# EAGLE design SC_1 (EAGLE 6.3)
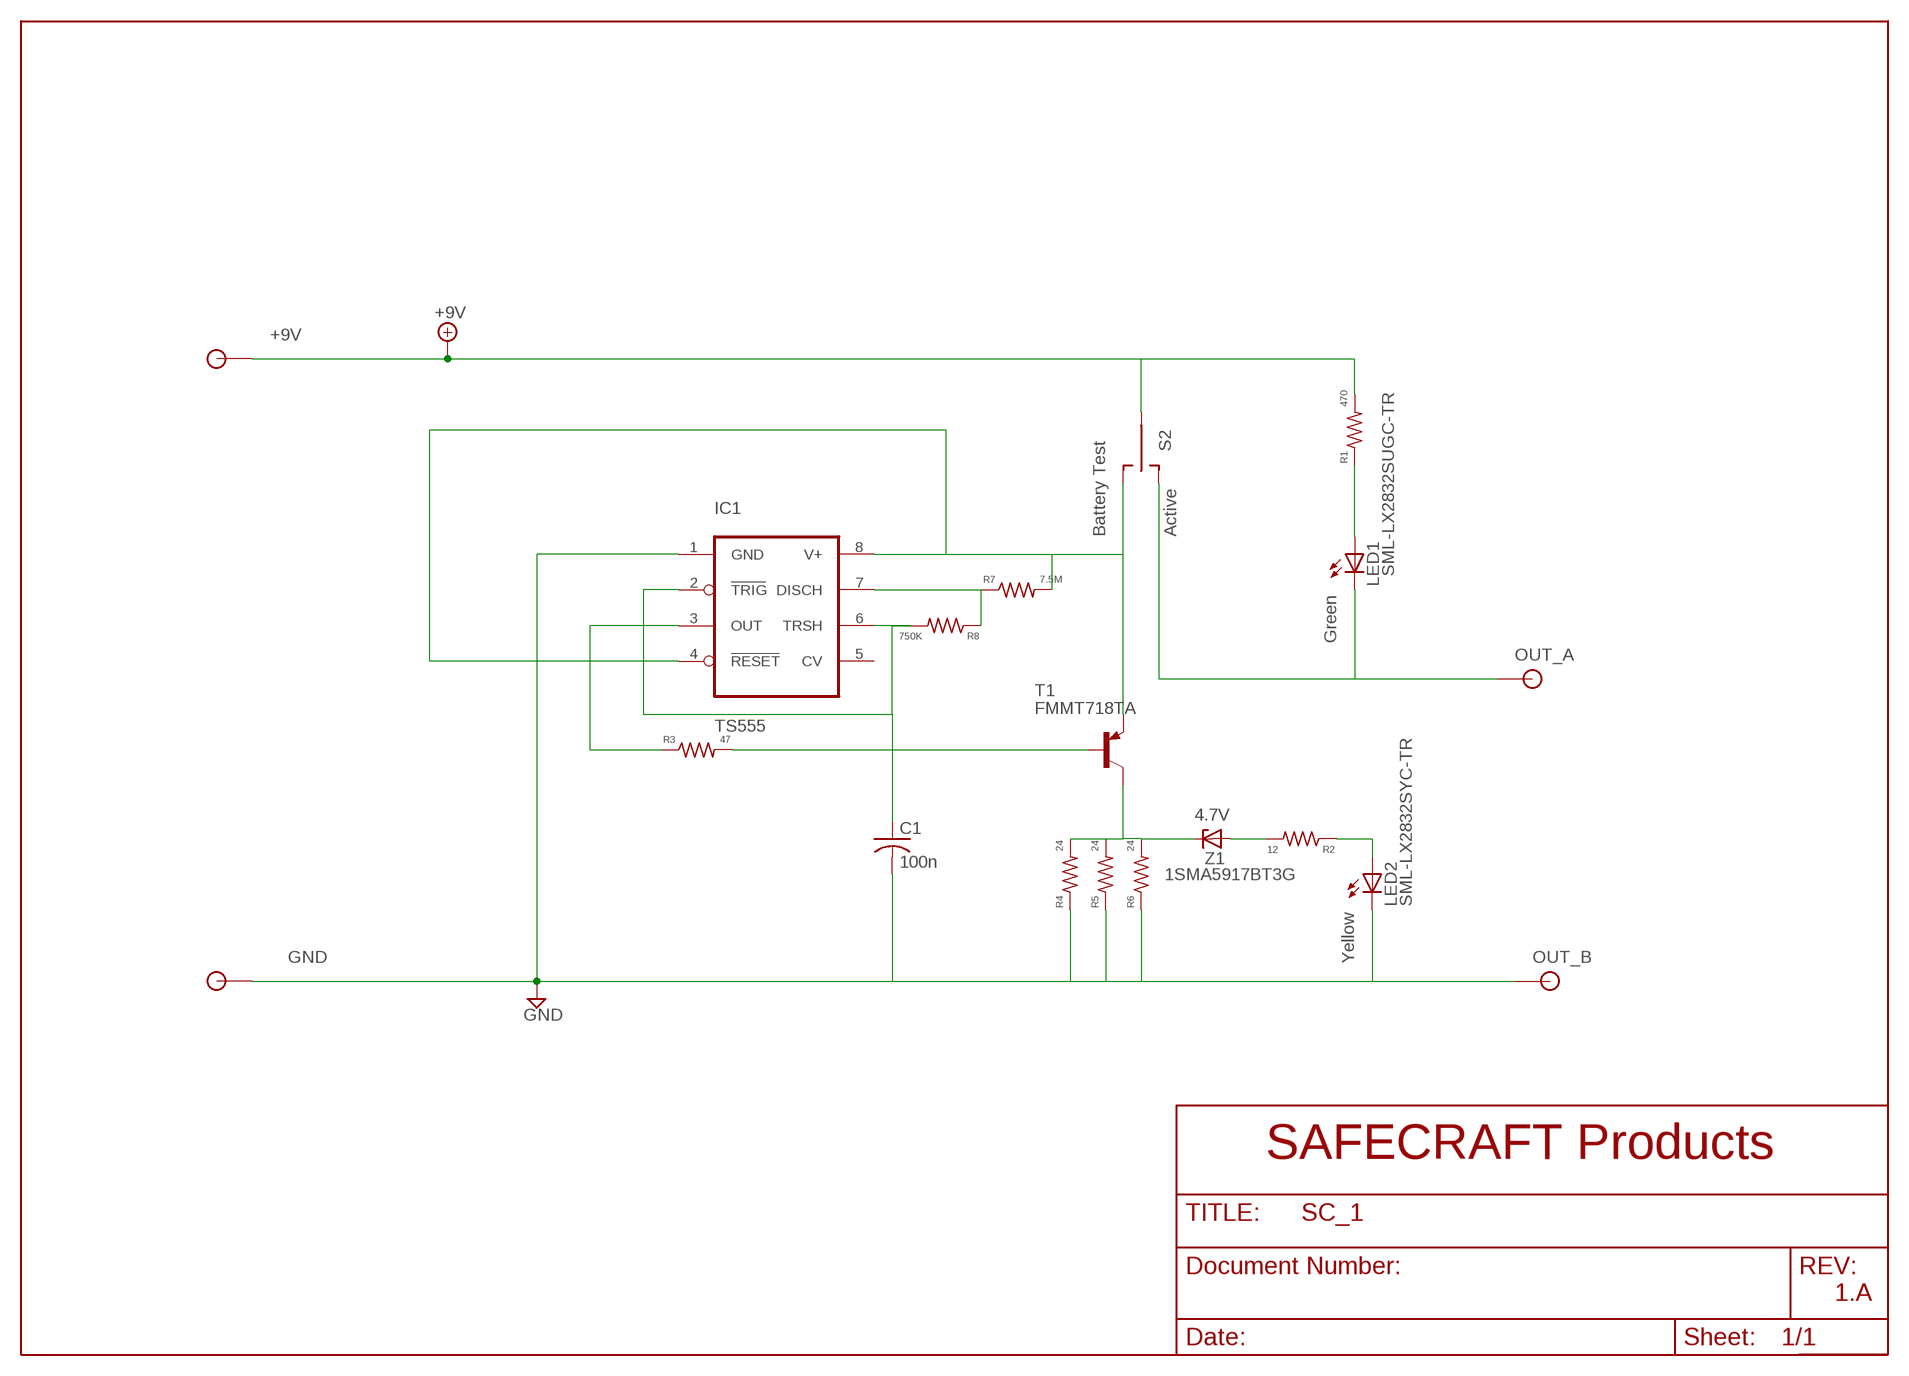
[diagram p0: schematic, sheet 1]

## Parts
C1  100n  C-USC0805  [C0805]
IC1  TS555  ICM7555SO08  [SO08]
LED1  SML-LX2832SUGC-TR  LEDP-LCC-2  [P-LCC-2]
LED2  SML-LX2832SYC-TR  LEDP-LCC-2  [P-LCC-2]
R1  470  R-US_R0805  [R0805]
R2  12  R-US_R0805  [R0805]
R3  47  R-US_R0805  [R0805]
R4  24  R-US_R1206  [R1206]
R5  24  R-US_R1206  [R1206]
R6  24  R-US_R1206  [R1206]
R7  7.5M  R-US_R0805  [R0805]
R8  750K  R-US_R0805  [R0805]
S2  TL39POB  [TL3XPO_NOHOLES]
T1  FMMT718TA  BC807-16-PNP-SOT23-BEC  [SOT23-BEC]
U$1  SOLDERPAD_NOHOLE  [SOLDERPAD_NOHOLES]
U$2  SOLDERPAD_NOHOLE  [SOLDERPAD_NOHOLES]
U$3  SOLDERPAD_NOHOLE  [SOLDERPAD_NOHOLES]
U$4  SOLDERPAD_NOHOLE  [SOLDERPAD_NOHOLES]
Z1  1SMA5917BT3G  ZENER-DIODESMB  [SMB]

## Nets
+9V: R1.2 S2.P$2(P) U$3.P$1
GND: C1.2 IC1.1(GND) LED2.C R4.1 R5.1 R6.1 U$2.P$1 U$4.P$1
N$1: IC1.4(RESET) IC1.8(V+) R7.2 S2.P$3(S) T1.E
N$5: R2.2 Z1.A
N$6: LED1.A R1.1
N$7: C1.1 IC1.2(TRIG) IC1.6(TRSH) R8.2
N$8: LED2.A R2.1
N$9: R3.2 T1.B
N$10: IC1.3(OUT) R3.1
N$12: IC1.7(DISCH) R7.1 R8.1
N$13: R4.2 R5.2 R6.2 T1.C Z1.C
OUT_A: LED1.C S2.P$1(O) U$1.P$1
Unconnected: IC1.5(CV)

## Notes on the sheet
- Battery Test | Active
- Green
- 4.7V
- Yellow | OUT_B
- SAFECRAFT Products
- 1.A

## Library data of the parts
C1 = rcl:C-US: CAPACITOR, American symbol
IC1 = Stofer:ICM7555: TIMER
LED1 LED2 = led:LED: LED OSRAM: - CHIPLED LG R971, LG N971, LY N971, LG Q971, LY Q971, LO R971, LY R971 LH N974, LH R974 LS Q976, LO Q976, LY Q976 LO Q996 - Hyper CHIPLED LW Q18S LB Q993, LB Q99A, LB R99A - SideLED LS A670, LO A670, LY A670, LG A670, LP A670 LB A673, LV A673, LT A673, LW A673 LH A674 LY A675 LS A676, LA A676, LO A676, LY A676, LW A676 LS A679, LY A679, LG A679 - Hyper Micro SIDELED® LS Y876, LA Y876, LO Y876, LY Y876 LT Y87S - SmartLED LW L88C, LW L88S LB L89C, LB L89S, LG L890 LS L89K, LO L89K, LY L89K LS L896, LA L896, LO L896, LY L896 - TOPLED LS T670, LO T670, LY T670, LG T670, LP T670 LSG T670, LSP T670, LSY T670, LOP T670, LYG T670 LG T671, LOG T671, LSG T671 LB T673, LV T673, LT T673, LW T673 LH T674 LS T676, LA T676, LO T676, LY T676, LB T676, LH T676, LSB T676, LW T676 LB T67C, LV T67C, LT T67C, LS T67K, LO T67K, LY T67K, LW E67C LS E67B, LA E67B, LO E67B, LY E67B, LB E67C, LV E67C, LT E67C LW T67C LS T679, LY T679, LG T679 LS T770, LO T770, LY T770, LG T770, LP T770 LB T773, LV T773, LT T773, LW T773 LH T774 LS E675, LA E675, LY E675, LS T675 LS T776, LA T776, LO T776, LY T776, LB T776 LHGB T686 LT T68C, LB T68C - Hyper Mini TOPLED® LB M676 - Mini TOPLED Santana® LG M470 LS M47K, LO M47K, LY M47K Source: http://www.osram.convergy.de LUXEON: - LUMILED® LXK2-PW12-R00, LXK2-PW12-S00, LXK2-PW14-U00, LXK2-PW14-V00 LXK2-PM12-R00, LXK2-PM12-S00, LXK2-PM14-U00 LXK2-PE12-Q00, LXK2-PE12-R00, LXK2-PE12-S00, LXK2-PE14-T00, LXK2-PE14-U00 LXK2-PB12-K00, LXK2-PB12-L00, LXK2-PB12-M00, LXK2-PB14-N00, LXK2-PB14-P00, LXK2-PB14-Q00 LXK2-PR12-L00, LXK2-PR12-M00, LXK2-PR14-Q00, LXK2-PR14-R00 LXK2-PD12-Q00, LXK2-PD12-R00, LXK2-PD12-S00 LXK2-PH12-R00, LXK2-PH12-S00 LXK2-PL12-P00, LXK2-PL12-Q00, LXK2-PL12-R00 Source: www.luxeon.com KINGBRIGHT: KA-3528ASYC Source: www.kingbright.com
R1-R8 = rcl:R-US_: RESISTOR, American symbol
S2 = switch:TL39PO: TINY SWITCH ON OFF ON Source: http://www2.produktinfo.conrad.com/datenblaetter/700000-724999/705152-da-01-de-Subminiaturschalter_TL_36YO.pdf
T1 = transistor:*-PNP-: PNP Transistror
U$1-U$4 = 1AA_Stofer:SOLDERPAD_NOHOLE
Z1 = diode:ZENER-DIODE: Z-Diode

## Board
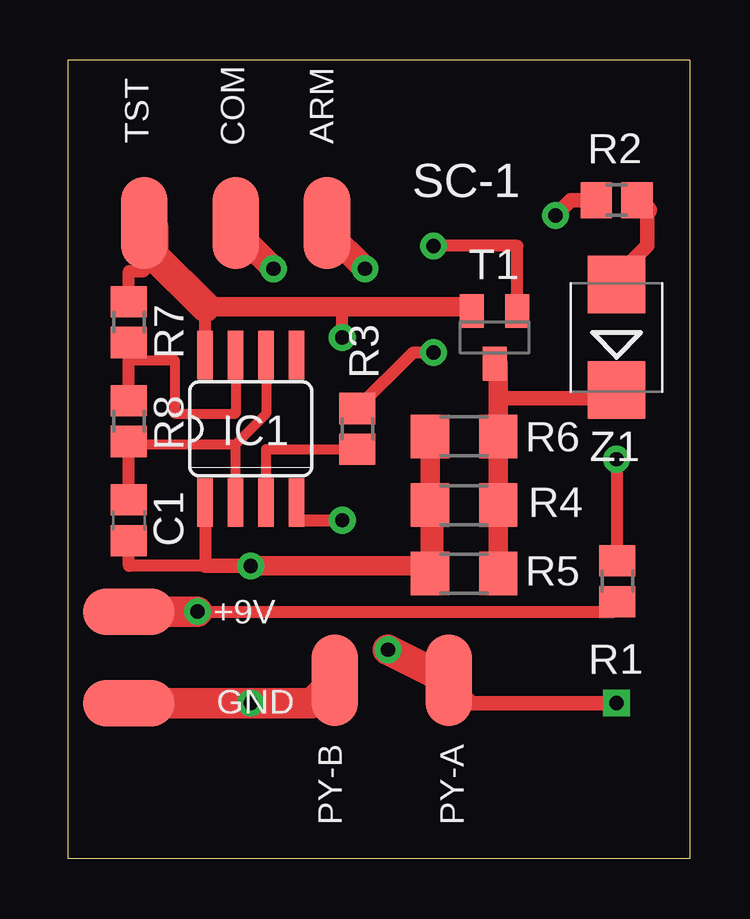
[diagram p1: board, top side]
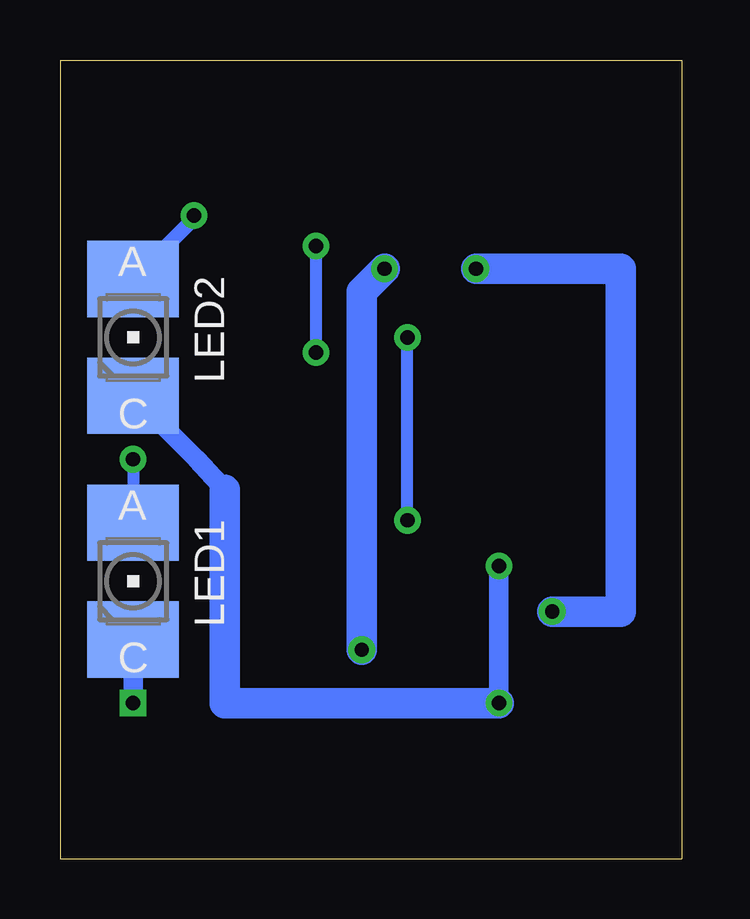
[diagram p2: board, bottom side, seen from below]

Size 25.91 x 33.27 mm. Coordinates in mm from the lower left corner, seen from the top.
Outline: 25.91,0 0,0 0,33.27 25.91,33.27 25.91,0
Copper layers (1*16): Top 0.035mm / dielectric 1.5mm / Bottom 0.035mm
Design rules "sparkfun": minimum track width 8mil, minimum drill 20mil, track to track 8mil, track to pad 8mil, pad to pad 8mil, via to via 8mil, smd to smd 8mil, copper to edge 10mil, drill to drill 8mil, minimum pad ring 12mil, minimum via ring 10mil, stop-mask expansion 4mil, vias tented up to drill 25mil, thermal gap 10mil

### Footprints (pad centres in the part's own frame; a part is rotated, then mirrored left to right if it is on the bottom)
C0805 = smd 1.3 x 1.5: 1 -0.85,0; 2 0.85,0
SO08 = smd 0.66 x 2.032: 1 -1.905,-3.073; 2 -0.635,-3.073; 3 0.635,-3.073; 4 1.905,-3.073; 5 1.905,3.073; 6 0.635,3.073; 7 -0.635,3.073; 8 -1.905,3.073
P-LCC-2 = smd 3.81 x 3.175: A 0,2.433; C 0,-2.433
R0805 = smd 1.3 x 1.5: 1 -0.85,0; 2 0.85,0
R1206 = smd 1.6 x 1.803: 1 -1.422,0; 2 1.422,0
TL3XPO_NOHOLES = smd 1.93 x 3.81: P$1 -3.81,0; P$2 0,0; P$3 3.81,0
SOT23-BEC = smd 1 x 1.4: B -0.95,-1.1; C 0,1.1; E 0.95,-1.1
SOLDERPAD_NOHOLES = smd 3.81 x 1.93: P$1 0,0
SMB = smd 2.4 x 2.4: A 2.2,0; C -2.2,0

### Placement (x,y rotation side)
C1  2.54,14.1 270 top
IC1  7.62,17.91 0 top
LED1  22.86,11.56 0 bottom
LED2  22.86,21.72 0 bottom
R1  22.89,11.56 270 top
R2  22.86,27.43 0 top
R3  12.06,17.91 90 top
R4  16.51,14.73 0 top
R5  16.51,11.87 0 top
R6  16.51,17.59 0 top
R7  2.54,22.35 90 top
R8  2.54,18.22 270 top
S2  6.98,26.48 180 top
T1  17.78,21.72 180 top
U$1  15.87,7.43 90 top
U$2  11.11,7.43 90 top
U$3  2.54,10.29 0 top
U$4  2.54,6.48 0 top
Z1  22.86,21.72 90 top

### Tracks (layer width: path | path; a pad name or v marks a point on that pad's centre or on a via)
+9V  (via drill 0.6)
  Top 0.406: 22.76,10.29 arc90 R1.2
  Top 0.508: v5.4,10.29 22.76,10.29
  Top 1.016: S2.P$2 6.98,26.16 v8.57,24.57
  Top 1.27: U$3.P$1 v5.4,10.29
  Bottom 1.27: v5.4,10.29 U$3.P$1 2.54,24.57 v8.57,24.57
GND  (via drill 0.6)
  Top 0.406: R5.1 15.09,12.19
  Top 0.508: IC1.1 5.71,12.19 2.54,12.19 C1.2
  Top 0.61: v7.62,12.19 5.71,12.19
  Top 0.813: R6.1 R4.1 | R4.1 R5.1 14.77,12.19 | R4.1 15.24,14.58 15.24,12.19 | 15.24,12.19 15.24,11.56 | 15.24,12.19 v7.62,12.19
  Top 1.27: U$4.P$1 v7.62,6.48 10.16,6.48 U$2.P$1
  Bottom 0.813: 19.05,15.37 20.21,16.64 LED2.C | v7.62,6.48 v7.62,12.19
  Bottom 1.27: 19.05,15.37 19.05,6.48 v7.62,6.48
N$1  (via drill 0.6)
  Top 0.406: IC1.4 9.53,14.1
  Top 0.508: IC1.8 5.71,22.99 | 3.56,26.29 S2.P$3 3.18,24.47 2.54,24.47 R7.2 | 9.53,14.1 v11.43,14.1 | v11.43,21.72 11.43,22.99
  Top 0.813: 5.71,22.99 11.43,22.99 16.66,22.99 T1.E
  Top 1.27: 5.71,22.99 3.56,25.15 3.56,26.29
  Bottom 0.508: v11.43,14.1 v11.43,21.72
N$5
  Top 0.61: 22.86,24.26 24.13,25.53 24.13,27.01
  Top 0.813: Z1.A 22.86,24.26 | 24.13,27.01 R2.2
N$6  (via drill 0.6)
  Top 0.508: v22.86,16.64 22.86,12.41 R1.1
  Bottom 0.508: v22.86,16.64 LED1.A
N$7
  Top 0.406: 2.54,17.27 6.98,17.27 | IC1.2 6.98,17.27 | IC1.6 8.26,18.54 6.98,17.27
  Top 0.508: R8.2 2.54,17.27 C1.1
N$8  (via drill 0.6)
  Top 0.61: R2.1 20.95,27.43 v20.32,26.8
  Bottom 0.61: v20.32,26.8 20.32,26.69 LED2.A
N$9  (via drill 0.6)
  Top 0.508: T1.B 18.73,25.53 v15.24,25.53 | v15.24,21.08 14.39,21.08 R3.2
  Bottom 0.508: v15.24,21.08 v15.24,25.53
N$10
  Top 0.406: IC1.3 8.26,17.06 R3.1
N$12
  Top 0.406: 2.54,20.76 4.45,20.76 4.45,18.54 6.98,18.54 IC1.7
  Top 0.508: R8.1 2.54,20.76 R7.1
N$13
  Top 0.406: 17.93,20.62 T1.C | Z1.C 22.86,19.18
  Top 0.61: 22.86,19.18 17.93,19.18
  Top 0.813: R5.2 R4.2 R6.2 17.93,19.18 17.93,20.62
OUT_A  (via drill 0.6)
  Top 0.61: v22.86,6.48 16.83,6.48 U$1.P$1
  Top 1.016: S2.P$1 10.79,26.16 v12.38,24.57
  Top 1.27: v13.33,8.7 U$1.P$1
  Bottom 0.813: LED1.C v22.86,6.48
  Bottom 1.27: v12.38,24.57 13.33,23.62 v13.33,8.7

### Text on the board
tPlace: TST | COM | ARM | SC-1 | +9V | GND | PY-B | PY-A
tDocu: SAFECRAFT